# Altium schematic sheet Channel.SchDoc
size A; SheetNumber: 3; SheetTotal: 10
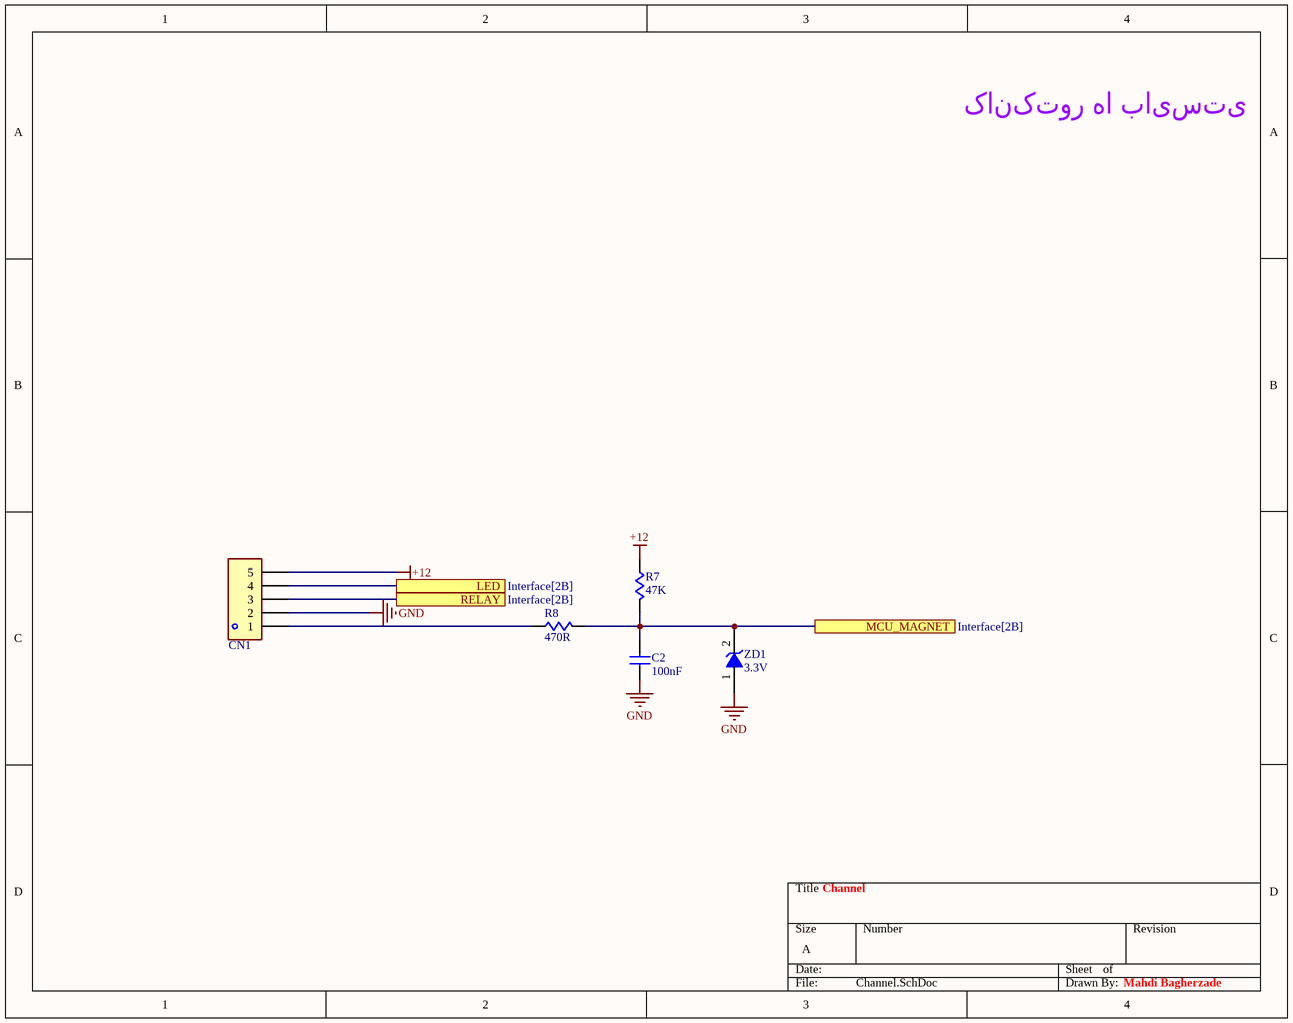
[diagram p0: Channel.SchDoc]

## Parts
C2  value 100nF  [C-0805]  (hidden comment: CAP Cer 100nF-50V-X7R-SMD)
CN1  Connector XH/VH/TE-Straight/Right-THD/SMD-?mm  [XH-5]  (value not drawn)
R7  value 47K  [R-0805]
R8  value 470R  [R-0805]
ZD1  Voltage: 3.3V  [SOD80]  (hidden comment: Zener -3.3V-SMD)

## Ports
LED (see Interface[2B]), MCU_MAGNET (see Interface[2B]), RELAY (see Interface[2B])

## Nets
+12: CN1.5 R7.1
GND: C2.2 CN1.2 ZD1.1(A)
LED: CN1.4 ; port LED
MCU_MAGNET: C2.1 R7.2 R8.2 ZD1.2(C) ; port MCU_MAGNET
RELAY: CN1.3 ; port RELAY
NetCN1_1: CN1.1 R8.1

## Notes on the sheet
- کانکتور ها بایستی در لبه بورد قرار بگیرند
- Channel
- Mahdi Bagherzade

## Library data of the parts
C2 = CAP-CER: CAPACITOR; Phone Number: 0915 8700 314; Voltage: 50V; Tolerance: X7R; Type: SMD; Publisher: Mahdi Bagherzadeh; ComponentLink1Description: Linkedin; ComponentLink1URL: https://ir.linkedin.com/in/mahdi-bagherzade; Published Date: 9-15-2024
CN1 = CN-5pin: CONNECTOR; Phone Number: 0915 8700 314; Publisher: Mahdi Bagherzadeh; ComponentLink1Description: Linkedin; ComponentLink1URL: https://ir.linkedin.com/in/mahdi-bagherzade; Published Date: 9-15-2024; Type: Straight/Right-THD/SMD; Size: ?mm; Value: XH/VH/TE
R7 R8 = RES: RESISTOR; Phone Number: 0915 8700 314; Tolerance: 5%; Power: 1/8W; Publisher: Mahdi Bagherzadeh; ComponentLink1Description: Linkedin; ComponentLink1URL: https://ir.linkedin.com/in/mahdi-bagherzade; Published Date: 9-15-2024
ZD1 = DIODE-ZENER: DIODE; Phone Number: 0915 8700 314; Power: Minimelf; Publisher: Mahdi Bagherzadeh; ComponentLink1Description: Linkedin; ComponentLink1URL: https://ir.linkedin.com/in/mahdi-bagherzade; Published Date: 9-15-2024; Type: SMD